# EAGLE design BRAIN (EAGLE 6.5.0)
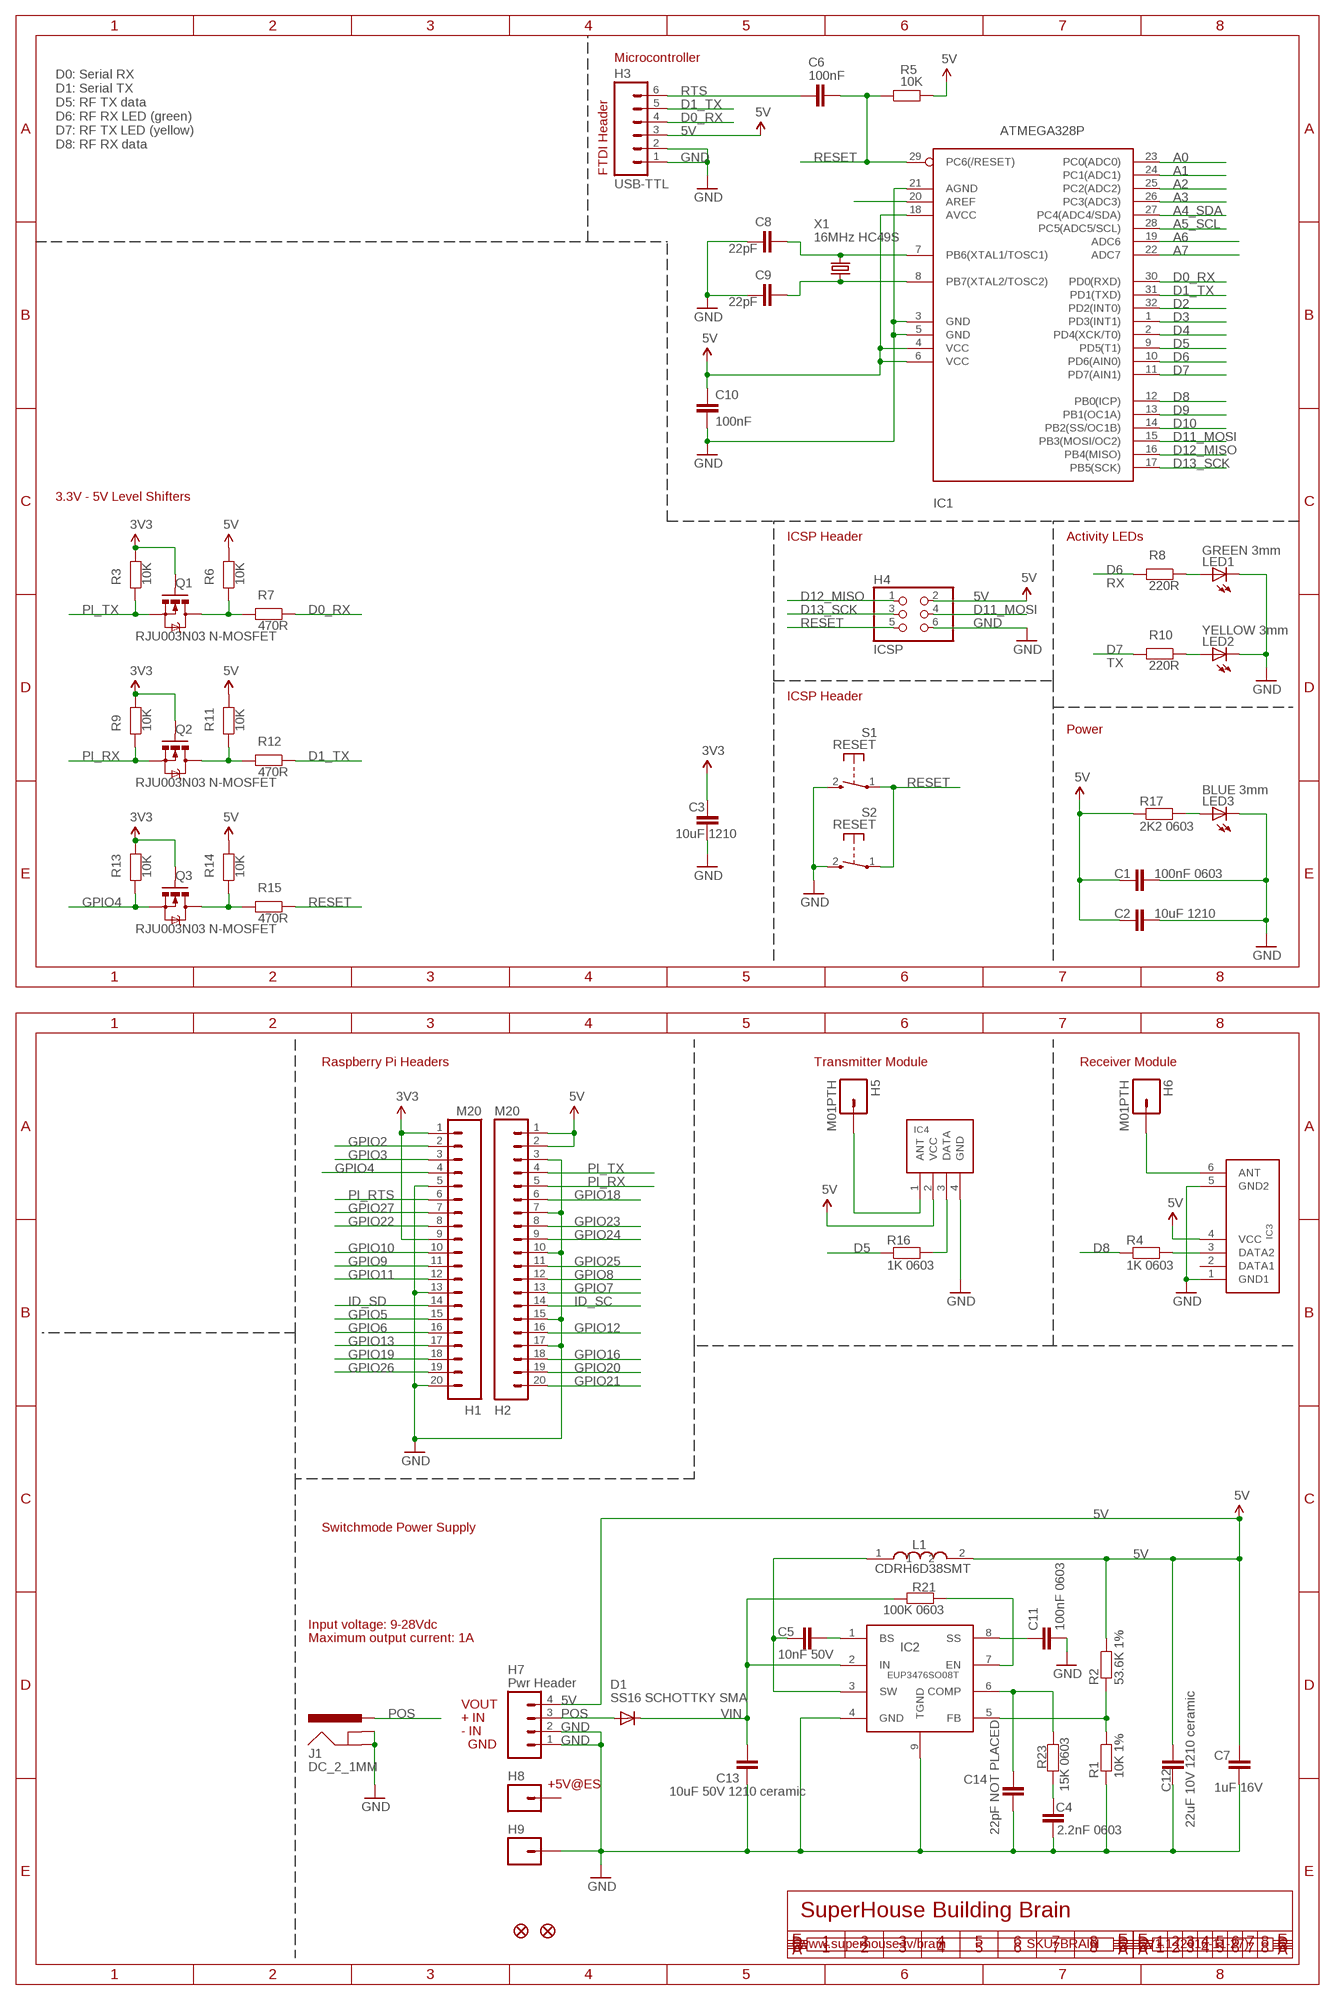
[diagram p0: schematic, sheet 1]

## Parts
C1  100nF 0603  CAP0603  [0603]
C2  10uF 1210  C-EUC1210  [C1210]
C3  10uF 1210  C-EUC1210  [C1210]
C4  2.2nF 0603  CAP0603  [0603]
C5  10nF 50V  CAP0603  [0603]
C6  100nF  CAP0603  [0603]
C7  1uF 16V  CAP0603  [0603]
C8  22pF  CAP0603  [0603]
C9  22pF  CAP0603  [0603]
C10  100nF  CAP0603  [0603]
C11  100nF 0603  CAP0603  [0603]
C12  22uF 10V 1210 ceramic  C-EUC1210  [C1210]
C13  10uF 50V 1210 ceramic  C-EUC1210  [C1210]
C14  22pF NOT PLACED  CAP0603  [0603]
D1  SS16 SCHOTTKY SMA  DIODESMAB  [SMA-SMB-DIODE]
H1  M20  [1X20]
H2  M20  [1X20]
H3  USB-TTL  M06SIP  [1X06]
H4  ICSP  PINHD-2X3  [2X03]
H5  M01PTH  [1X01]
H6  M01PTH  [1X01]
H7  Pwr Header  M04PTH  [1X04]
H8  M01PTH  [1X01]
H9  M01PTH  [1X01]
IC1  ATMEGA328P  AVR-MEGA8-AI  [TQFP32-08]
IC2  EUP3476SO08T  [SO08T]
IC3  RXB1  RXB1SHORTFLAT  [RX-B1-SHORT-FLAT]
IC4  TX-C1FLAT  [TX-C1-FLAT]
J1  DC_2_1MM  POWER_JACKPTH  [POWER_JACK_PTH]
L1  CDRH6D38SMT  [CDRH]
LED1  GREEN 3mm  LED3MM  [LED3MM]
LED2  YELLOW 3mm  LED3MM  [LED3MM]
LED3  BLUE 3mm  LED3MM  [LED3MM]
Q1  RJU003N03 N-MOSFET  MOSFET-NSOT-323  [SOT32-3]
Q2  RJU003N03 N-MOSFET  MOSFET-NSOT-323  [SOT32-3]
Q3  RJU003N03 N-MOSFET  MOSFET-NSOT-323  [SOT32-3]
R1  10K 1%  RESISTOR0603  [0603]
R2  53.6K 1%  RESISTOR0603  [0603]
R3  10K  RESISTOR0603  [0603]
R4  1K 0603  RESISTOR0603  [0603]
R5  10K  RESISTOR0603  [0603]
R6  10K  RESISTOR0603  [0603]
R7  470R  RESISTOR0603  [0603]
R8  220R  RESISTOR0603  [0603]
R9  10K  RESISTOR0603  [0603]
R10  220R  RESISTOR0603  [0603]
R11  10K  RESISTOR0603  [0603]
R12  470R  RESISTOR0603  [0603]
R13  10K  RESISTOR0603  [0603]
R14  10K  RESISTOR0603  [0603]
R15  470R  RESISTOR0603  [0603]
R16  1K 0603  RESISTOR0603  [0603]
R17  2K2 0603  RESISTOR0603  [0603]
R21  100K 0603  RESISTOR0603  [0603]
R23  15K 0603  RESISTOR0603  [0603]
S1  RESET  TAC_SWITCH_2PIN  [TACTILE_SWITCH_SMD_2PIN_TINY]
S2  RESET  TAC_SWITCH_2PIN  [TACTILE_SWITCH_SMD_2PIN_TINY]
U$4  FIDUCIAL1X2.5  [FIDUCIAL-1X2.5]
U$5  FIDUCIAL1X2.5  [FIDUCIAL-1X2.5]
X1  16MHz HC49S  CRYSTALHC49UV  [HC49U-V]

## Nets
3.3V: C3.1 H1.1 H1.9 Q1.1(G) Q2.1(G) Q3.1(G) R3.1 R9.1 R13.1 ; supply symbol labelled 3V3
5V: C1.1 C2.2 C7.1 C10.1 C12.1 H2.1 H2.2 H3.3 H4.2 H7.4 IC1.4(VCC) IC1.6(VCC) IC1.18(AVCC) IC3.4(VCC) IC4.2(VCC) L1.2 R2.2 R5.2 R6.1 R11.1 R14.1 R17.1
A0: IC1.23(PC0(ADC0))
A1: IC1.24(PC1(ADC1))
A2: IC1.25(PC2(ADC2))
A3: IC1.26(PC3(ADC3))
A4_SDA: IC1.27(PC4(ADC4/SDA))
A5_SCL: IC1.28(PC5(ADC5/SCL))
A6: IC1.19(ADC6)
A7: IC1.22(ADC7)
AREF: IC1.20(AREF)
D0_RX: H3.4 IC1.30(PD0(RXD)) R7.1
D1_TX: H3.5 IC1.31(PD1(TXD)) R12.1
D2: IC1.32(PD2(INT0))
D3: IC1.1(PD3(INT1))
D4: IC1.2(PD4(XCK/T0))
D5: IC1.9(PD5(T1)) R16.1
D6: IC1.10(PD6(AIN0)) R8.2
D7: IC1.11(PD7(AIN1)) R10.2
D8: IC1.12(PB0(ICP)) R4.1
D9: IC1.13(PB1(OC1A))
D10: IC1.14(PB2(SS/OC1B))
D11_MOSI: H4.4 IC1.15(PB3(MOSI/OC2))
D12_MISO: H4.1 IC1.16(PB4(MISO))
D13_SCK: H4.3 IC1.17(PB5(SCK))
GND: C1.2 C2.1 C3.2 C4.2 C7.2 C8.1 C9.1 C10.2 C11.2 C12.2 C13.2 C14.2 H1.5 H1.13 H1.20 H2.3 H2.7 H2.10 H2.15 H2.17 H3.1 H3.2 H4.6 H7.1 H7.2 H9.1 IC1.3(GND) IC1.5(GND) IC1.21(AGND) IC2.4(GND) IC2.9(TGND) IC3.1(GND1) IC3.5(GND2) IC4.4(GND) J1.GND J1.GNDBREAK LED1.K(C) LED2.K(C) LED3.K(C) R1.1 S1.2(S) S2.2(S)
GPIO2: H1.2
GPIO3: H1.3
GPIO4: H1.4 Q3.2(S) R13.2
GPIO5: H1.15
GPIO6: H1.16
GPIO7: H2.13
GPIO8: H2.12
GPIO9: H1.11
GPIO10: H1.10
GPIO11: H1.12
GPIO12: H2.16
GPIO13: H1.17
GPIO16: H2.18
GPIO18: H2.6
GPIO19: H1.18
GPIO20: H2.19
GPIO21: H2.20
GPIO22: H1.8
GPIO23: H2.8
GPIO24: H2.9
GPIO25: H2.11
GPIO26: H1.19
GPIO27: H1.7
ID_SC: H2.14
ID_SD: H1.14
N$1: LED3.A R17.2
N$2: Q1.3(D) R6.2 R7.2
N$3: H6.1 IC3.6(ANT)
N$4: H5.1 IC4.1(ANT)
N$5: C8.2 IC1.7(PB6(XTAL1/TOSC1)) X1.2
N$6: IC4.3(DATA) R16.2
N$7: Q2.3(D) R11.2 R12.2
N$8: Q3.3(D) R14.2 R15.2
N$9: IC2.7(EN) R21.1
N$10: IC2.5(FB) R1.2 R2.1
N$11: C14.1 IC2.6(COMP) R23.2
N$12: C11.1 IC2.8(SS)
N$50: C9.2 IC1.8(PB7(XTAL2/TOSC2)) X1.1
N$53: LED1.A R8.1
N$55: LED2.A R10.1
N$73: C5.2 IC2.1(BS)
N$78: C5.1 IC2.3(SW) L1.1
N$135: IC3.3(DATA2) R4.2
N$9913: C4.1 R23.1
PI_RTS: H1.6
PI_RX: H2.5 Q2.2(S) R9.2
PI_TX: H2.4 Q1.2(S) R3.2
POS: D1.A H7.3 J1.PWR
RESET: C6.2 H4.5 IC1.29(PC6(/RESET)) R5.1 R15.1 S1.1(P) S2.1(P)
RTS: C6.1 H3.6
VIN: C13.1 D1.C IC2.2(IN) R21.2
Unconnected: H8.1 IC3.2(DATA1)

## Notes on the sheet
- Microcontroller
- D0: Serial RX
  D1: Serial TX
  D5: RF TX data
  D6: RF RX LED (green)
  D7: RF TX LED (yellow)
  D8: RF RX data
- FTDI Header
- 3.3V - 5V Level Shifters
- ICSP Header | Activity LEDs
- RX
- TX
- ICSP Header
- Power
- Raspberry Pi Headers | Transmitter Module | Receiver Module
- Switchmode Power Supply
- Input voltage: 9-28Vdc
- Maximum output current: 1A
- VOUT
- + IN
- - IN
- GND
- +5V@ES
- SuperHouse Building Brain
- www.superhouse.tv/brain | SKU: BRAIN | V1.1 (2016-11-27)

## Library data of the parts
C1 C7 = freetronics:CAP: Capacitor Standard 0603 ceramic capacitor, and 0.1" leaded capacitor.
C2 C3 C12 C13 = freetronics-jon:C-EU: CAPACITOR, European symbol
C4 C5 C11 C14 = freetronics-marc:CAP: Capacitor Standard 0603 ceramic capacitor, and 0.1" leaded capacitor.
C6 C8-C10 = freetronics-master-v1.1:CAP: Capacitor Standard 0603 ceramic capacitor, and 0.1" leaded capacitor.
D1 = freetronics-jon:DIODE: Diode These are standard reverse protection diodes and small signal diodes. SMA package can handle up to about 1A. SOD-323 can handle about 200mA. What the SOD-323 package when ordering, there are some mfgs out there that are 5-pin packages.
H1 H2 = freetronics-master-v1:M20: This is just like the LOCK variant in that the holes are staggared by 5 mil, but except for the last two holes. They are not altered from the "standard" footprint layout. This is used for a special purpose on the layout of our Graphic LCD Backpack. Make sure you want to use this device before selecting it for you project!
H3 = freetronics:M06: Header 6 Standard 6-pin 0.1" header. Use with straight break away headers (SKU : PRT-00116), right angle break away headers (PRT-00553), swiss pins (PRT-00743), machine pins (PRT-00117), and female headers (PRT-00115). Molex polarized connector foot print use with SKU : PRT-08094 with associated crimp pins and housings. NOTES ON THE VARIANTS LOCK and LOCK_LONGPADS... This footprint was designed to help hold the alignment of a through-hole component (i.e. 6-pin header) while soldering it into place. You may notice that each hole has been shifted either up or down by 0.005 of an inch from it's more standard position (which is a perfectly straight line). This slight alteration caused the pins (the squares in the middle) to touch the edges of the holes. Because they are alternating, it causes a "brace" to hold the component in place. 0.005 has proven to be the perfect amount of "off-center" position when using our standard breakaway headers. Although looks a little odd when you look at the bare footprint, once you have a header in there, the alteration is very hard to notice. Also, if you push a header all the way into place, it is covered up entirely on the bottom side. This idea of altering the position of holes to aid alignment will be further integrated into the Sparkfun Library for other footprints. It can help hold any component with 3 or more connection pins.
H4 = pinhead:PINHD-2X3: PIN HEADER
H5 H6 H8 H9 = freetronics:M01: Header 1 Standard 1-pin 0.1" header. Use with straight break away headers (SKU : PRT-00116), right angle break away headers (PRT-00553), swiss pins (PRT-00743), machine pins (PRT-00117), and female headers (PRT-00115).
H7 = freetronics:M04: Header 4 Standard 4-pin 0.1" header. Use with straight break away headers (SKU : PRT-00116), right angle break away headers (PRT-00553), swiss pins (PRT-00743), machine pins (PRT-00117), and female headers (PRT-00115). Molex polarized connector foot print use with SKU : PRT-08231 with associated crimp pins and housings.
IC1 = freetronics-master-v1.1:AVR-MEGA8: MICROCONTROLLER 8 Kbytes FLASH 1 kbytes SRAM 512 bytes EEPROM USART 6-channel 10 bit ADC 2-channel 8 bit ADC
IC2 = freetronics-jon:EUP3476
IC3 = freetronics-master-v1:RXB1SHORT
IC4 = freetronics-jon:TX-C1
J1 = freetronics:POWER_JACK: Power Jack This is the standard 5.5mm barrel jack for power. The PTH is the most common, proven, reliable, footprint. All others are experimental. The Slot footprint only works if the mill layer is transmitted to the PCB fab house so be warned. Spark Fun Electronics SKU : PRT-00119. Mating wall wart : TOL-00298 (and others)
L1 = freetronics-jon:CDRH6D38: Inductor
LED1-LED3 = freetronics-2:LED: LEDs Standard schematic elements and footprints for 5mm, 3mm, 1206, and 0603 sized LEDs. 5mm - Spark Fun Electronics SKU : COM-00529 (and others)
Q1-Q3 = freetronics-jon:MOSFET-N: Basic N-Channel MOSFET
R1 R2 R4 R16 R17 = freetronics-jon:RESISTOR: Resistor Basic schematic elements and footprints for 0603, 1206, and PTH 1/10th watt (small) resistors.
R3 R5-R15 = freetronics-master-v1.1:RESISTOR: Resistor Basic schematic elements and footprints for 0603, 1206, and PTH 1/10th watt (small) resistors.
R21 R23 = freetronics-marc:RESISTOR: Resistor Basic schematic elements and footprints for 0603, 1206, and PTH 1/10th watt (small) resistors.
S1 S2 = freetronics-jon:TAC_SWITCH_2PIN: Momentary Tactile Switch - 2 pin
U$4 U$5 = freetronics-original:FIDUCIAL: Fiducial Alignment Points Various fiducial points for machine vision alignment.
X1 = freetronics:CRYSTAL: Crystals Various standard crystals. Proven footprints. Spark Fun Electronics SKU : COM-00534

## Net classes
1 VCC: width 0.305 mm

## Board
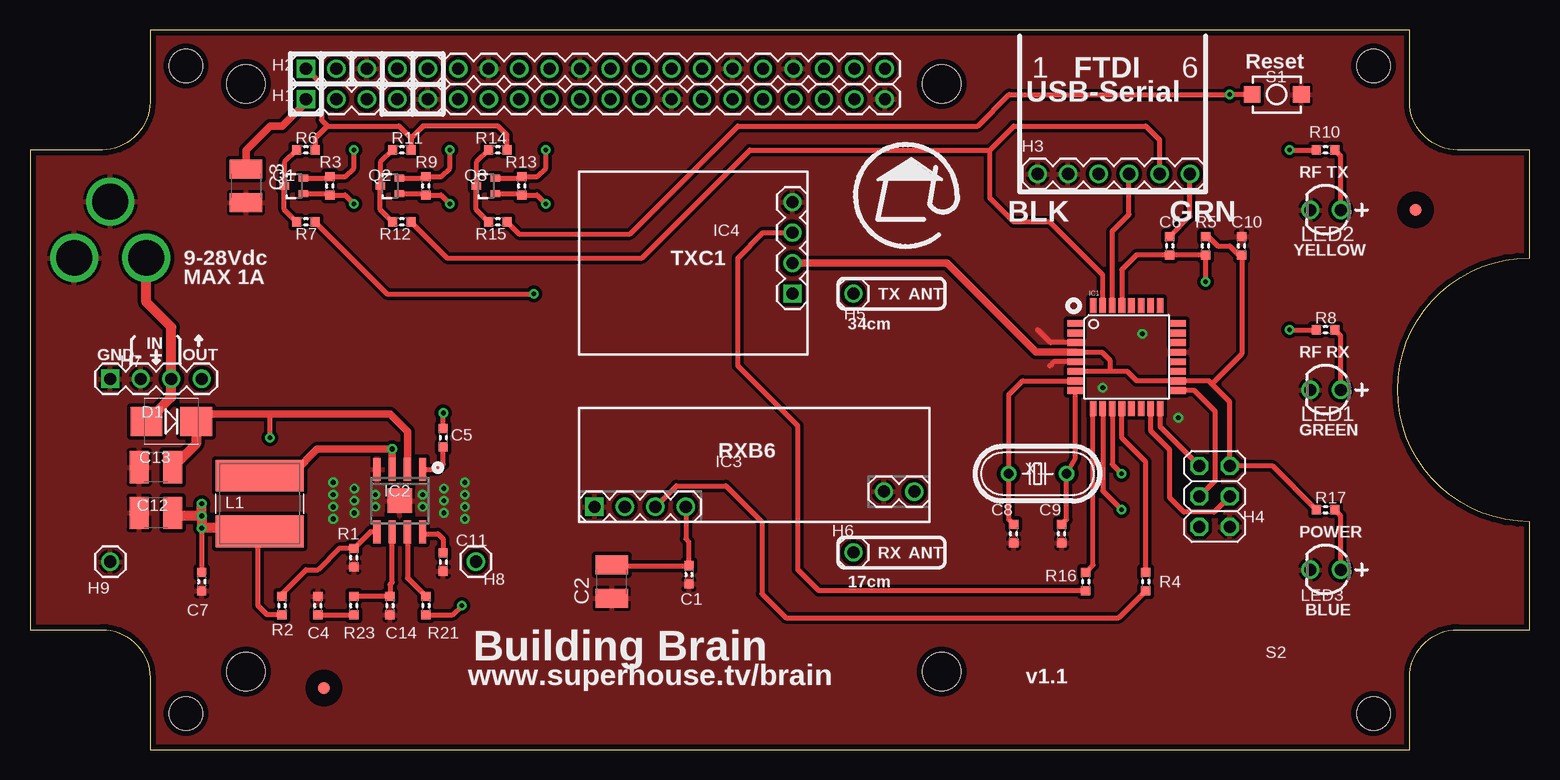
[diagram p1: board, top side]
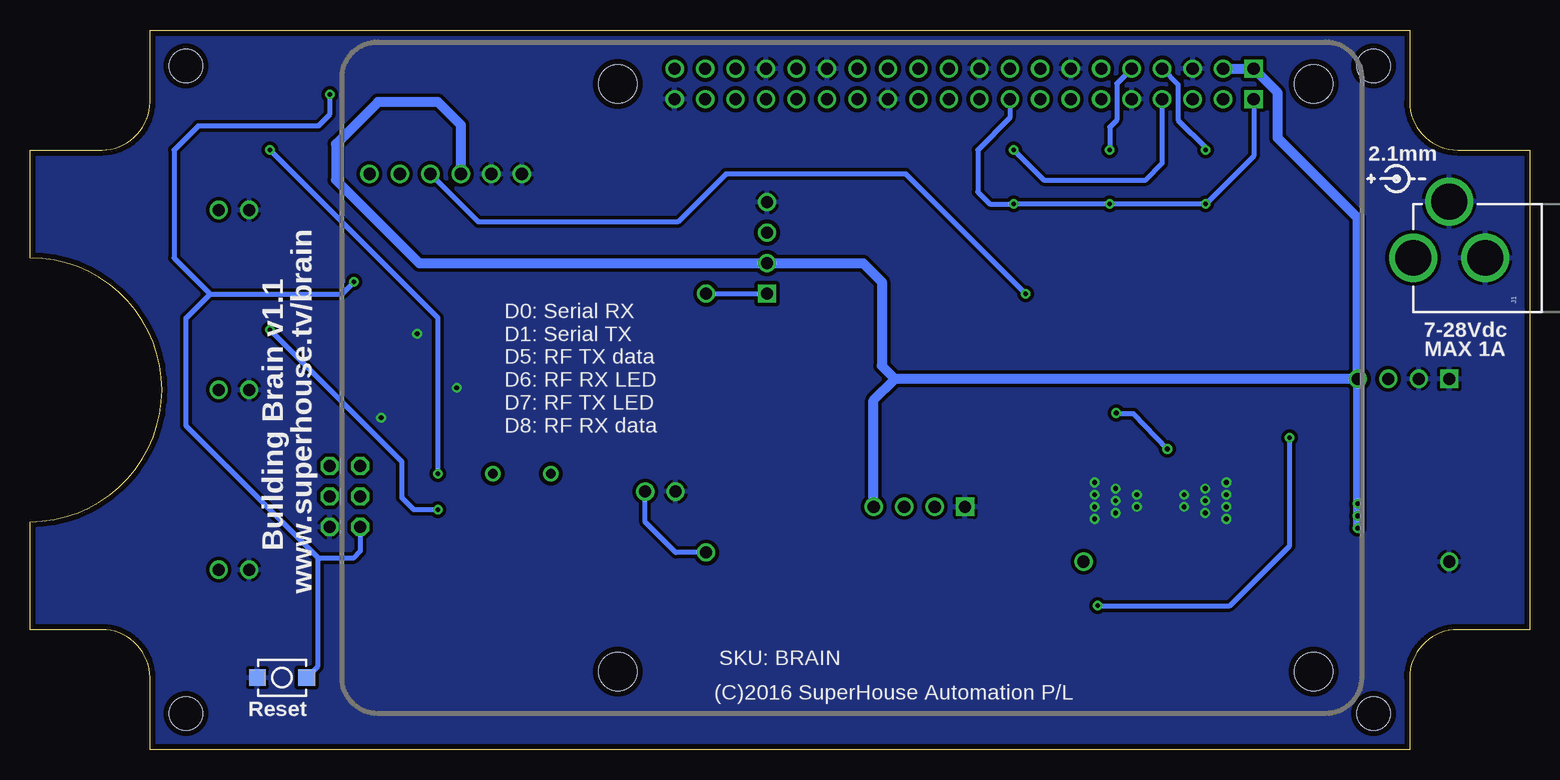
[diagram p2: board, bottom side, seen from below]

Size 125 x 60 mm. Coordinates in mm from the lower left corner, seen from the top.
Outline: 0,10 6,10 arc-90 10,6 10,0 115,0 115,6 arc-90 119,10 125,10 125,19 arc-90 114,30 arc-90 125,41 125,50 119,50 arc-90 115,54 115,60 10,60 10,54 arc-90 6,50 0,50 0,10
Copper layers (1*16): Top 0.035mm / dielectric 1.5mm / Bottom 0.035mm
Design rules "default *": minimum track width 10mil, minimum drill 24mil, track to track 12mil, track to pad 12mil, pad to pad 12mil, via to via 12mil, smd to smd 8mil, copper to edge 18mil, drill to drill 8mil, minimum pad ring 10mil, minimum via ring 8mil, stop-mask expansion 4mil, vias tented up to drill 0mil, thermal gap 10mil
Holes 3.2 mm at 18,6.5 76,6.5 76,55.5 18,55.5
Holes 2.8 mm at 13,57 13,3 112,3 112,57
tRestrict: area 23.5,4.1 to 25.5,6.1; area 114.5,44 to 116.5,46

### Footprints (pad centres in the part's own frame; a part is rotated, then mirrored left to right if it is on the bottom)
0603 = smd 0.762 x 0.762: 1 -0.762,0; 2 0.762,0
C1210 = smd 1.6 x 2.7: 1 -1.4,0; 2 1.4,0
SMA-SMB-DIODE = smd 2.65 x 2.4: A 2.075,0; C -2.075,0
1X20 = drill 1.016 square: 1 0,0 | drill 1.016: 2 2.54,0; 3 5.08,0; 4 7.62,0; 5 10.16,0; 6 12.7,0; 7 15.24,0; 8 17.78,0; 9 20.32,0; 10 22.86,0; 11 25.4,0; 12 27.94,0; 13 30.48,0; 14 33.02,0; 15 35.56,0; 16 38.1,0; 17 40.64,0; 18 43.18,0; 19 45.72,0; 20 48.26,0
1X06 = drill 1.016: 1 0,0; 2 2.54,0; 3 5.08,0; 4 7.62,0; 5 10.16,0; 6 12.7,0
2X03 = drill 1.016 octagon: 1 -2.54,-1.27; 2 -2.54,1.27; 3 0,-1.27; 4 0,1.27; 5 2.54,-1.27; 6 2.54,1.27
1X01 = drill 1.016: 1 0,0
1X04 = drill 1.016 square: 1 0,0 | drill 1.016: 2 2.54,0; 3 5.08,0; 4 7.62,0
TQFP32-08 = smd 1.27 x 0.559: 1 -4.293,2.8; 2 -4.293,2; 3 -4.293,1.2; 4 -4.293,0.4; 5 -4.293,-0.4; 6 -4.293,-1.2; 7 -4.293,-2; 8 -4.293,-2.8; 17 4.293,-2.8; 18 4.293,-2; 19 4.293,-1.2; 20 4.293,-0.4; 21 4.293,0.4; 22 4.293,1.2; 23 4.293,2; 24 4.293,2.8 | smd 0.559 x 1.27: 9 -2.8,-4.293; 10 -2,-4.293; 11 -1.2,-4.293; 12 -0.4,-4.293; 13 0.4,-4.293; 14 1.2,-4.293; 15 2,-4.293; 16 2.8,-4.293; 25 2.8,4.293; 26 2,4.293; 27 1.2,4.293; 28 0.4,4.293; 29 -0.4,4.293; 30 -1.2,4.293; 31 -2,4.293; 32 -2.8,4.293
SO08T = smd 1.905 x 0.6: 1 -2.6,1.905; 2 -2.6,0.635; 3 -2.6,-0.635; 4 -2.6,-1.905; 5 2.6,-1.905; 6 2.6,-0.635; 7 2.6,0.635; 8 2.6,1.905 | smd 2.057 x 2.057: 9 0,0
RX-B1-SHORT-FLAT = drill 1.016 square: 1 0,0 | drill 1.016: 2 2.54,0; 3 5.08,0; 4 7.62,0; 5 24.13,1.27; 6 26.67,1.27
TX-C1-FLAT = drill 1.016 square: 1 0,0 | drill 1.016: 2 2.54,0; 3 5.08,0; 4 7.62,0
POWER_JACK_PTH = drill 2.997: GND 0,7.7; GNDBREAK 4.7,10.7; PWR 0,13.7
CDRH = smd 7.3 x 2.65: 1 0,2.325; 2 0,-2.325
LED3MM = drill 1: A -1.27,0; K 1.27,0
SOT32-3 = smd 0.6 x 0.8: 1 -0.65,-0.8; 2 0.65,-0.8; 3 0,0.8
TACTILE_SWITCH_SMD_2PIN_TINY = smd 1.4 x 1.4: 1 -2.05,0; 2 2.05,0
FIDUCIAL-1X2.5 = smd 1 x 1: 1 0,0
HC49U-V = drill 0.813: 1 -2.413,0; 2 2.413,0

### Placement (x,y rotation side)
C1  54.93,14.57 270 top
C2  48.5,14 90 top
C3  18,47 270 top
C4  24,12 90 top
C5  34.45,26 270 top
C6  95,42 270 top
C7  14.32,14 270 top
C8  82,18 90 top
C9  86,18 90 top
C10  101,42 90 top
C11  34.45,15.63 270 top
C12  10.51,19.73 180 top
C13  10.51,23.54 180 top
C14  30,12 270 top
D1  11.78,27.35 180 top
H1  23,54.23 0 top
H2  23,56.77 0 top
H3  84,48 0 top
H4  98.75,21.1 270 top
H5  68.64,38.02 0 top
H6  68.64,16.43 0 top
H7  6.7,30.91 0 top
H8  37.18,15.67 270 top
H9  6.7,15.67 270 top
IC1  91.42,32.74 0 top
IC2  30.83,20.75 270 top
IC3  47.05,20.24 0 top
IC4  63.56,38.02 90 top
J1  -4,41 90 bottom
L1  19.14,20.51 0 top
LED1  108,30 180 top
LED2  108,45 180 top
LED3  108,15 180 top
Q1  22,47 90 top
Q2  30,47 90 top
Q3  38,47 90 top
R1  27,16 90 top
R2  21,12 270 top
R3  25,47 90 top
R4  93,14 270 top
R5  98,42 90 top
R6  23,50 180 top
R7  23,44 180 top
R8  108,35 180 top
R9  33,47 90 top
R10  108,50 180 top
R11  31,50 180 top
R12  31,44 180 top
R13  41,47 90 top
R14  39,50 180 top
R15  39,44 180 top
R16  88,14 270 top
R17  108,20 0 top
R21  33,12 270 top
R23  27,12 90 top
S1  103.92,54.62 0 top
S2  104,6 180 bottom
U$4  24.51,5.11 270 top
U$5  115.51,44.99 270 top
X1  84,23 180 top

### Tracks (layer width: path | path; a pad name or v marks a point on that pad's centre or on a via)
3.3V  (via drill 0.4)
  Top 0.305: 25,46.35 R3.1 | 33,46.35 R9.1 | 41,46.35 R13.1
  Top 0.406: Q1.1 25,46.35 | Q2.1 33,46.35 | Q3.1 41,46.35 | R3.1 26.26,46.24 v27,45.5 | R9.1 34.26,46.24 v35,45.5 | R13.1 42.26,46.24 v43,45.5
  Top 0.61: H1.1 23,54 21,52 20,52 18,50 C3.1
  Bottom 0.406: H1.1 23,49.5 v27,45.5 v35,45.5 v43,45.5 45,45.5 46,46.5 46,50 43.32,52.68 H1.9
5V  (via drill 0.4)
  Top 0.305: R5.2 98.24,42.76 | C10.1 100.76,41.24 101,41 | 24.76,52.04 24.76,52
  Top 0.406: 31.76,51 R11.1 | R14.1 39.76,51.24 39,52 32.76,52 31.76,51 | H2.1 24.3,55.47 24.3,52.5 24.76,52.04 | R17.1 103.59,23.64 H4.2 100.02,28.98 98.5,30.5 | 98.5,30.5 98.26,30.74 IC1.18 92.26,30.74 91.46,31.54 90,31.54 | 90,31.54 IC1.6 | IC1.4 89.36,33.14 90,32.5 90,31.54 | 98.24,42.76 99,42 100,42 100.76,41.24 | 101,41 101,33 98.5,30.5 | 19.36,18.97 L1.2 19,18.04 19,12 19.76,11.24 R2.2 | v14.32,18.46 C7.1 | R6.1 23.76,51 24.76,52 30.76,52 31.76,51 | IC3.4 54.67,17.59 54.93,17.33 C1.1 49.26,15.33
  Top 0.61: v14.32,19.48 14.32,19.73 | IC1.4 83.86,33.14 76.44,40.56 IC4.2 | 49.26,15.33 49.19,15.4 C2.2
  Top 0.813: v14.32,19.48 v14.32,20.49 | v14.32,19.48 v14.32,18.46 18.86,18.46 L1.2 | v14.32,19.48 12.16,19.48 C12.1
  Bottom 0.813: H2.2 H2.1 21,54.77 21,51 14.32,44.32 H7.4 | H7.4 v14.32,19.48 v14.32,18.46 | H7.4 52.91,30.91 | 52.91,30.91 54,32 54,39 55.56,40.56 IC4.2 92.56,40.56 99.5,47.5 99.5,50.5 96,54 91,54 89.08,52.08 H3.3 | IC3.4 54.67,29.14 52.91,30.91
D0_RX  (via drill 0.4)
  Top 0.406: IC1.30 90.22,43.22 91.62,44.62 H3.4 | R7.1 29.76,38 v42,38
  Bottom 0.406: v42,38 52,48 67,48 71,44 87.62,44 H3.4
D1_TX
  Top 0.406: IC1.31 89.42,39.58 85,44 82,44 80,46 80,50 | 80,50 82,52 93,52 94.16,50.84 H3.5 | R12.1 34.76,41 51,41 60,50 80,50
D5
  Top 0.406: IC1.9 88.62,15.38 R16.1
D6  (via drill 0.4)
  Top 0.406: IC1.10 89.42,21.58 v91,20 | v105,35 R8.2
  Bottom 0.406: v91,20 93,20 94,21 94,24 v105,35
D7  (via drill 0.4)
  Top 0.406: IC1.11 90.22,23.78 v91,23 | v105,50 R10.2
  Bottom 0.406: v91,23 91,36 v105,50
D8
  Top 0.305: 91,28.42 IC1.12
  Top 0.406: R4.1 93,24 91,26 91,28.42
D11_MOSI
  Top 0.406: H4.4 98.71,19.8 96.2,19.8 95,21 95,25 93.42,26.58 IC1.15
D12_MISO
  Top 0.406: H4.1 94.22,26.9 IC1.16
D13_SCK
  Top 0.406: IC1.17 97.06,29.94 98.8,28.2 98.8,22.43 H4.3
GND  (via drill 0.4, 0.4 pad 0.4)
  Top 0.406: IC1.5 85.34,32.34 85,32 | IC1.3 85.06,33.94 84,35
  other vias: 27.03,20.75 32.73,21.25 32.73,20.24 28.79,20.24 36.26,21.25 27.03,21.76 36.26,22.27 36.26,20.24 92.73,34.67 27.03,19.73 25.27,19.22 25.27,21.25 25.27,20.24 25.27,22.27 28.79,21.25 36.26,19.22 34.49,20.75 34.49,19.73 34.49,21.76 89.43,30.17 95.73,27.67
  pour Bottom: 0,10 0,50 6,50 arc90 10,54 10,60 115,60 115,54 arc90 119,50 125,50 125,41 arc90 114,30 arc90 125,19 125,10 119,10 arc90 115,6 115,0 10,0 10,6 arc90 6,10
  pour Top: 0,10 0,50 6,50 arc90 10,54 10,60 115,60 115,54 arc90 119,50 125,50 125,41 arc90 114,30 arc90 125,19 125,10 119,10 arc90 115,6 115,0 10,0 10,6 arc90 6,10
GPIO4  (via drill 0.4)
  Top 0.305: 41,47.65 R13.2
  Top 0.406: Q3.2 41,47.65 | R13.2 42.26,47.76 43,48.5 v43,50
  Bottom 0.406: v43,50 40.5,47.5 32,47.5 30.62,48.88 H1.4
N$1
  Top 0.406: LED3.A 109.27,19.49 R17.2
N$2
  Top 0.406: R6.2 21.2,48.96 Q1.3 21.2,45.04 R7.2
N$3
  Bottom 0.406: H6.1 71.18,16.43 73.72,18.97 IC3.6
N$4
  Bottom 0.406: H5.1 IC4.1
N$5
  Top 0.406: C8.2 81.59,19.18 X1.2 81.59,29.59 82.74,30.74 IC1.7
N$6
  Top 0.406: R16.2 65.76,13.24 64,15 64,27 59,32 59,41 61.1,43.1 IC4.3
N$7
  Top 0.406: R12.2 29.2,45.04 Q2.3 29.2,48.96 R11.2
N$8
  Top 0.406: R15.2 37.2,45.04 Q3.3 37.2,48.96 R14.2
N$9
  Top 0.406: IC2.7 31.46,14.3 R21.1
N$10
  Top 0.406: R2.1 21,13 23,15 24,15 25.76,16.76 R1.2 28.38,18.15 IC2.5
N$11
  Top 0.406: IC2.6 30.19,13.95 30,13.76 C14.1 R23.2
N$12
  Top 0.406: IC2.8 32.88,18 34,18 34.45,17.55 C11.1
N$50
  Top 0.406: C9.2 86.41,19.18 X1.1 87.13,24.29 IC1.8
N$53
  Top 0.406: LED1.A 109.27,34.49 R8.1
N$55
  Top 0.406: LED2.A 109.27,49.49 R10.1
N$73
  Top 0.406: IC2.1 34,23.35 34.45,23.8 C5.2
N$78  (via drill 0.4 pad 0.4)
  Top 0.406: C5.1 v34.45,28.06
  Top 0.61: IC2.3 v30.19,25.06 23.95,25.06 22,23.11 22,22 21.17,22.83 L1.1
  Bottom 0.406: v30.19,25.06 33,28 34.39,28 v34.45,28.06
N$135
  Top 0.406: IC3.3 53.89,22 58,22 61,19 61,13 63,11 90.76,11 R4.2
N$9913
  Top 0.406: C4.1 R23.1
PI_RX  (via drill 0.4)
  Top 0.305: 33,47.65 R9.2
  Top 0.406: Q2.2 33,47.65 | R9.2 34.26,47.76 35,48.5 v35,50
  Bottom 0.406: H2.5 34.4,55.53 34.4,52.5 35,51.9 v35,50
PI_TX  (via drill 0.4)
  Top 0.406: Q1.2 25,47.65 R3.2 26.26,47.76 27,48.5 v27,50
  Bottom 0.406: H2.4 29.3,55.45 29.3,52.5 27,50.2 v27,50
POS
  Top 0.61: D1.A 10.51,28.11
  Top 0.813: 10.51,28.11 11.78,29.38 H7.3 11.78,35.22 9.7,37.3 J1.PWR
RESET  (via drill 0.4)
  Top 0.406: IC1.29 91.02,40.02 92.24,41.24 C6.2 R5.1 v98,39 | R15.1 40.76,43 50,43 59,52 79,52 81.62,54.62 v100,54.62 S1.1
  Bottom 0.406: 101,16 112,27 112,36 110,38 | 110,38 99,38 v98,39 | 101,16 98,16 97.48,16.52 H4.5 | 110,38 113,41 113,50 111,52 101,52 100,53 v100,54.62 | S2.1 101,6.95 101,16
RTS
  Top 0.406: C6.1 96.7,44.46 H3.6
VIN  (via drill 0.4)
  Top 0.406: R21.2 35.24,11.24 v36,12 | v20,26 20,28
  Top 0.61: D1.C 13.72,27.35 | IC2.2 31.46,26.54 30,28 20,28 14.5,28 D1.C | 14.2,27 D1.C
  Top 0.813: D1.C 13.85,25.48 C13.1
  Bottom 0.406: v36,12 25,12 20,17 v20,26

### Text on the board
tPlace: Reset | 1 | FTDI | 6 | USB-Serial | RF TX | BLK | GRN | YELLOW | 9-28Vdc | TXC1 | MAX 1A | TX | ANT | 34cm | IN | RF RX | GND | - + | OUT | GREEN | RXB6 | POWER | RX | ANT | 17cm | BLUE | Building Brain | v1.1 | www.superhouse.tv/brain
bPlace: 2.1mm | 7-28Vdc | MAX 1A | D0: Serial RX / D1: Serial TX / D5: RF TX data / D6: RF RX LED / D7: RF TX LED / D8: RF RX data | Building Brain v1.1 | www.superhouse.tv/brain | SKU: BRAIN | (C)2016 SuperHouse Automation P/L | Reset
tNames: S1 | S2